# EAGLE design esc (EAGLE 7.6.0)
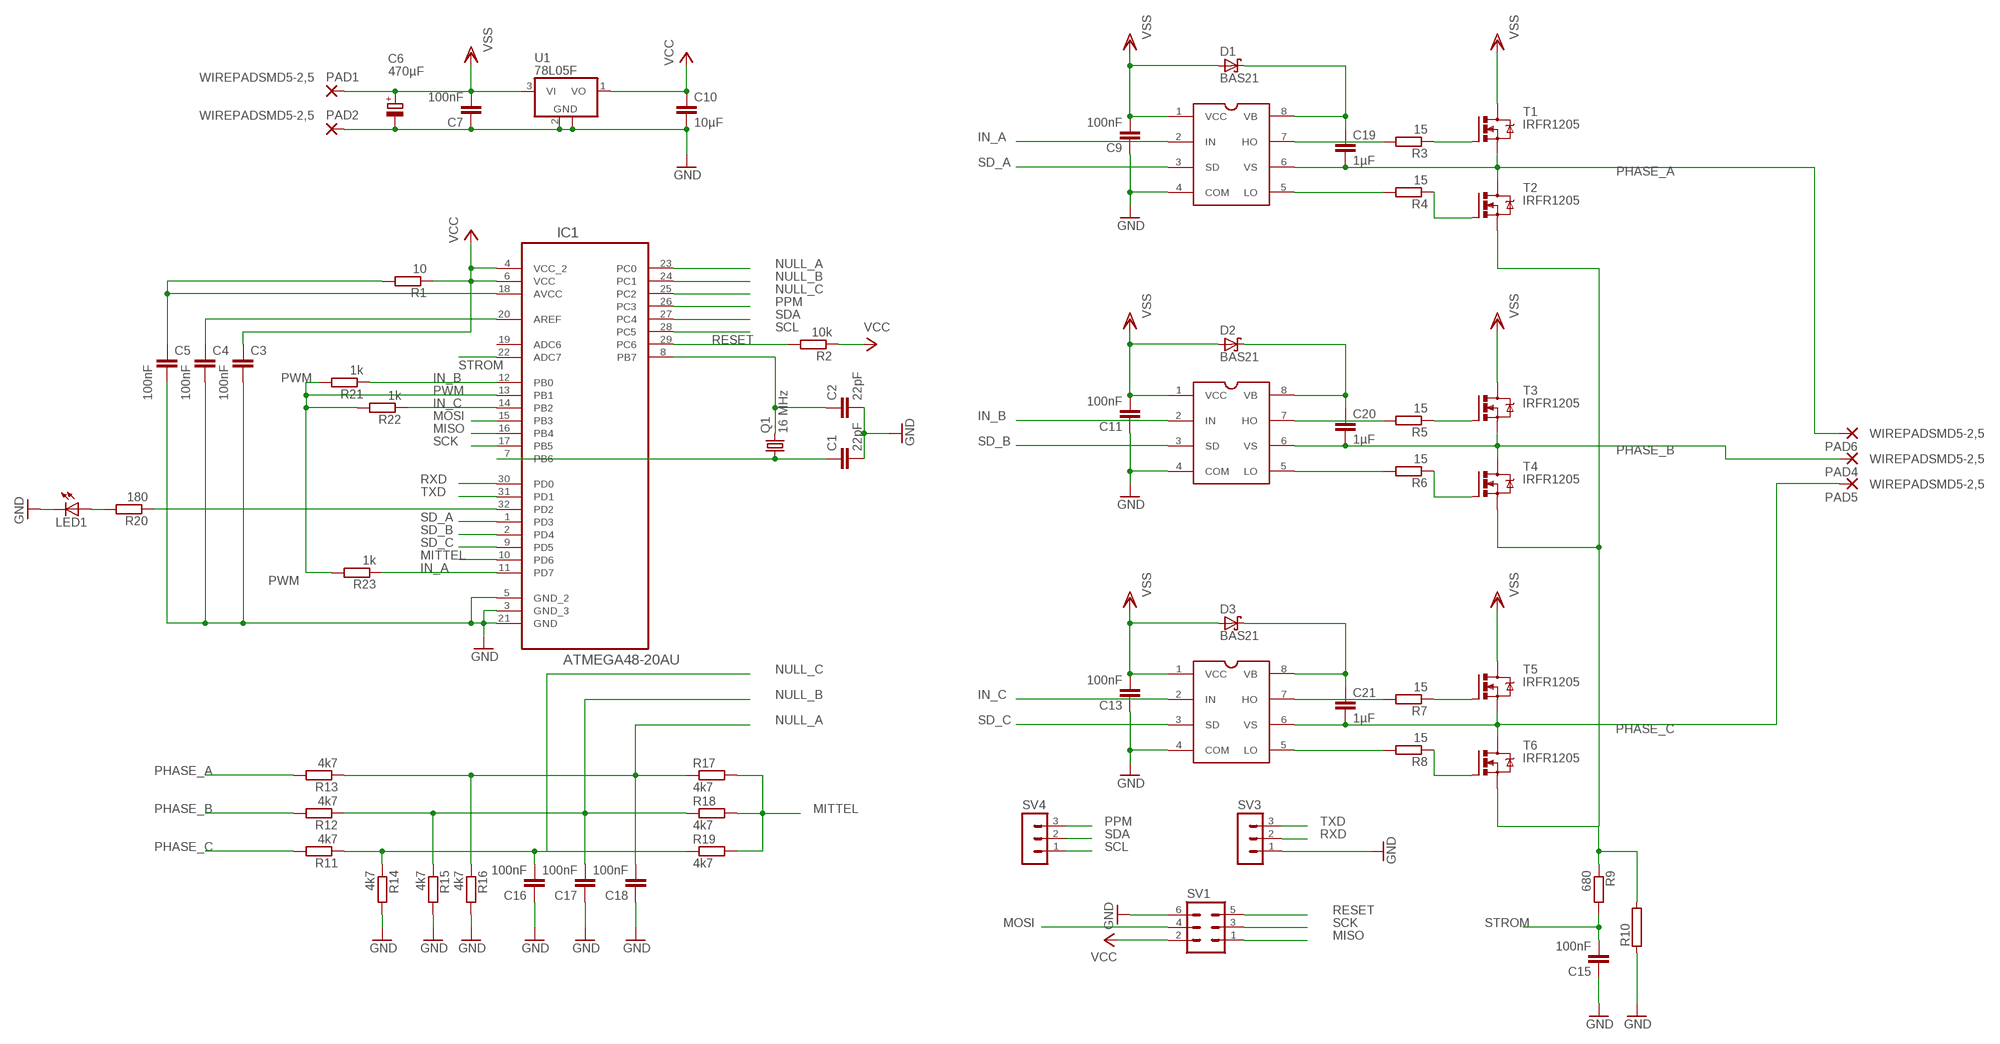
[diagram p0: schematic, sheet 1]

## Parts
C1  22pF  C-EUC1206  [C1206]
C2  22pF  C-EUC1206  [C1206]
C3  100nF  C-EUC1206  [C1206]
C4  100nF  C-EUC1206  [C1206]
C5  100nF  C-EUC1206  [C1206]
C6  470µF  CPOL-EUE5-10.5  [E5-10,5]
C7  100nF  C-EUC1206  [C1206]
C9  100nF  C-EUC1206  [C1206]
C10  10µF  C-EUC1206  [C1206]
C11  100nF  C-EUC1206  [C1206]
C13  100nF  C-EUC1206  [C1206]
C15  100nF  C-EUC1206  [C1206]
C16  100nF  C-EUC1206  [C1206]
C17  100nF  C-EUC1206  [C1206]
C18  100nF  C-EUC1206  [C1206]
C19  1µF  C-EUC1206  [C1206]
C20  1µF  C-EUC1206  [C1206]
C21  1µF  C-EUC1206  [C1206]
D1  BAS21  BAS40  [SOT23]
D2  BAS21  BAS40  [SOT23]
D3  BAS21  BAS40  [SOT23]
IC1  ATMEGA48-20AU  [QFP80P900X900X120-32N]
LED1  LEDCHIPLED_1206  [CHIPLED_1206]
PAD1  WIREPADSMD5-2,5  [5-2,5]
PAD2  WIREPADSMD5-2,5  [5-2,5]
PAD4  WIREPADSMD5-2,5  [5-2,5]
PAD5  WIREPADSMD5-2,5  [5-2,5]
PAD6  WIREPADSMD5-2,5  [5-2,5]
Q1  16 MHz  CRYSTALHC49UP  [HC49UP]
R1  10  R-EU_R1206  [R1206]
R2  10k  R-EU_R1206  [R1206]
R3  15  R-EU_R1206  [R1206]
R4  15  R-EU_R1206  [R1206]
R5  15  R-EU_R1206  [R1206]
R6  15  R-EU_R1206  [R1206]
R7  15  R-EU_R1206  [R1206]
R8  15  R-EU_R1206  [R1206]
R9  680  R-EU_R1206  [R1206]
R10  RCA5150  [CA5150]
R11  4k7  R-EU_R1206  [R1206]
R12  4k7  R-EU_R1206  [R1206]
R13  4k7  R-EU_R1206  [R1206]
R14  4k7  R-EU_R1206  [R1206]
R15  4k7  R-EU_R1206  [R1206]
R16  4k7  R-EU_R1206  [R1206]
R17  4k7  R-EU_R1206  [R1206]
R18  4k7  R-EU_R1206  [R1206]
R19  4k7  R-EU_R1206  [R1206]
R20  180  R-EU_R1206  [R1206]
R21  1k  R-EU_R1206  [R1206]
R22  1k  R-EU_R1206  [R1206]
R23  1k  R-EU_R1206  [R1206]
SV1  ML6  [ML6]
SV3  MA03-1  [MA03-1]
SV4  MA03-1  [MA03-1]
T1  IRFR1205  [DPACK]
T2  IRFR1205  [DPACK]
T3  IRFR1205  [DPACK]
T4  IRFR1205  [DPACK]
T5  IRFR1205  [DPACK]
T6  IRFR1205  [DPACK]
U1  78L05F  [SOT89]
U$1  IR2104S  [IR2104S]
U$2  IR2104S  [IR2104S]
U$3  IR2104S  [IR2104S]

## Nets
GND: C1.2 C2.2 C3.2 C4.2 C5.2 C6.- C7.1 C9.1 C10.2 C11.1 C13.1 C15.1 C16.1 C17.1 C18.1 IC1.3(GND_3) IC1.5(GND_2) IC1.21(GND) LED1.C PAD2.1(P) R10.1 R14.2 R15.2 R16.2 SV1.6 SV3.1 U1.2(GND) U1.2@1(GND) U$1.4(COM) U$2.4(COM) U$3.4(COM)
IN_A: IC1.11(PD7) R23.1 U$1.2(IN)
IN_B: IC1.12(PB0) R21.1 U$2.2(IN)
IN_C: IC1.14(PB2) R22.1 U$3.2(IN)
MISO: IC1.16(PB4) SV1.1
MITTEL: IC1.10(PD6) R17.2 R18.2 R19.2
MOSI: IC1.15(PB3) SV1.4
N$1: C1.1 IC1.7(PB6) Q1.1
N$2: C5.1 IC1.18(AVCC) R1.2
N$3: C2.1 IC1.8(PB7) Q1.2
N$4: C4.1 IC1.20(AREF)
N$5: R3.1 T1.1(G)
N$6: R4.1 T2.1(G)
N$8: R9.1 R10.2 T2.3(S) T4.3(S) T6.3(S)
N$9: C20.1 D2.3(C) U$2.8(VB)
N$10: C19.1 D1.3(C) U$1.8(VB)
N$11: R5.2 U$2.7(HO)
N$12: R3.2 U$1.7(HO)
N$13: R4.2 U$1.5(LO)
N$14: R6.2 U$2.5(LO)
N$15: R5.1 T3.1(G)
N$16: R6.1 T4.1(G)
N$17: LED1.A R20.2
N$18: C21.1 D3.3(C) U$3.8(VB)
N$19: R7.2 U$3.7(HO)
N$20: R8.2 U$3.5(LO)
N$21: R7.1 T5.1(G)
N$22: R8.1 T6.1(G)
N$24: IC1.32(PD2) R20.1
NULL_A: C18.2 IC1.23(PC0) R13.1 R16.1 R17.1
NULL_B: C17.2 IC1.24(PC1) R12.1 R15.1 R18.1
NULL_C: C16.2 IC1.25(PC2) R11.1 R14.1 R19.1
PHASE_A: C19.2 PAD6.1(P) R13.2 T1.3(S) T2.2(D) U$1.6(VS)
PHASE_B: C20.2 PAD4.1(P) R12.2 T3.3(S) T4.2(D) U$2.6(VS)
PHASE_C: C21.2 PAD5.1(P) R11.2 T5.3(S) T6.2(D) U$3.6(VS)
PPM: IC1.26(PC3) SV4.3
PWM: IC1.13(PB1) R21.2 R22.2 R23.2
RESET: IC1.29(PC6) R2.2 SV1.5
RXD: IC1.30(PD0) SV3.2
SCK: IC1.17(PB5) SV1.3
SCL: IC1.28(PC5) SV4.1
SD_A: IC1.1(PD3) U$1.3(SD)
SD_B: IC1.2(PD4) U$2.3(SD)
SD_C: IC1.9(PD5) U$3.3(SD)
SDA: IC1.27(PC4) SV4.2
STROM: C15.2 IC1.22(ADC7) R9.2
TXD: IC1.31(PD1) SV3.3
VCC: C3.1 C10.1 IC1.4(VCC_2) IC1.6(VCC) R1.1 R2.1 SV1.2 U1.1(VO)
VSS: C6.+ C7.2 C9.2 C11.2 C13.2 D1.1(A) D2.1(A) D3.1(A) PAD1.1(P) T1.2(D) T3.2(D) T5.2(D) U1.3(VI) U$1.1(VCC) U$2.1(VCC) U$3.1(VCC)
Unconnected: IC1.19(ADC6)

## Library data of the parts
C1-C5 C7 C9-C11 C13 C15-C21 = rcl:C-EU: CAPACITOR, European symbol
C6 = rcl:CPOL-EU: POLARIZED CAPACITOR, European symbol
D1-D3 = diode:BAS40: Silicon Schottky Diodes General-purpose diode for high-speed switching
IC1 = Atmel_By_element14_Batch_1-00:ATMEGA48-20AU: 8-bit Microcontroller with 8K Bytes In-System Programmable Flash; MPN: ATMEGA48-20AU; OC_FARNELL: 9171312; OC_NEWARK: 68T2999; PACKAGE: TQFP-32; SUPPLIER: Atmel
LED1 = led:LED: LED OSRAM: - CHIPLED LG R971, LG N971, LY N971, LG Q971, LY Q971, LO R971, LY R971 LH N974, LH R974 LS Q976, LO Q976, LY Q976 LO Q996 - Hyper CHIPLED LW Q18S LB Q993, LB Q99A, LB R99A - SideLED LS A670, LO A670, LY A670, LG A670, LP A670 LB A673, LV A673, LT A673, LW A673 LH A674 LY A675 LS A676, LA A676, LO A676, LY A676, LW A676 LS A679, LY A679, LG A679 - Hyper Micro SIDELED® LS Y876, LA Y876, LO Y876, LY Y876 LT Y87S - SmartLED LW L88C, LW L88S LB L89C, LB L89S, LG L890 LS L89K, LO L89K, LY L89K LS L896, LA L896, LO L896, LY L896 - TOPLED LS T670, LO T670, LY T670, LG T670, LP T670 LSG T670, LSP T670, LSY T670, LOP T670, LYG T670 LG T671, LOG T671, LSG T671 LB T673, LV T673, LT T673, LW T673 LH T674 LS T676, LA T676, LO T676, LY T676, LB T676, LH T676, LSB T676, LW T676 LB T67C, LV T67C, LT T67C, LS T67K, LO T67K, LY T67K, LW E67C LS E67B, LA E67B, LO E67B, LY E67B, LB E67C, LV E67C, LT E67C LW T67C LS T679, LY T679, LG T679 LS T770, LO T770, LY T770, LG T770, LP T770 LB T773, LV T773, LT T773, LW T773 LH T774 LS E675, LA E675, LY E675, LS T675 LS T776, LA T776, LO T776, LY T776, LB T776 LHGB T686 LT T68C, LB T68C - Hyper Mini TOPLED® LB M676 - Mini TOPLED Santana® LG M470 LS M47K, LO M47K, LY M47K Source: http://www.osram.convergy.de LUXEON: - LUMILED® LXK2-PW12-R00, LXK2-PW12-S00, LXK2-PW14-U00, LXK2-PW14-V00 LXK2-PM12-R00, LXK2-PM12-S00, LXK2-PM14-U00 LXK2-PE12-Q00, LXK2-PE12-R00, LXK2-PE12-S00, LXK2-PE14-T00, LXK2-PE14-U00 LXK2-PB12-K00, LXK2-PB12-L00, LXK2-PB12-M00, LXK2-PB14-N00, LXK2-PB14-P00, LXK2-PB14-Q00 LXK2-PR12-L00, LXK2-PR12-M00, LXK2-PR14-Q00, LXK2-PR14-R00 LXK2-PD12-Q00, LXK2-PD12-R00, LXK2-PD12-S00 LXK2-PH12-R00, LXK2-PH12-S00 LXK2-PL12-P00, LXK2-PL12-Q00, LXK2-PL12-R00 Source: www.luxeon.com KINGBRIGHT: KA-3528ASYC Source: www.kingbright.com
PAD1 PAD2 PAD4-PAD6 = wirepad:WIREPAD: Wire PAD connect wire on PCB
Q1 = crystal:CRYSTAL: CRYSTAL; OC_FARNELL: unknown; OC_NEWARK: unknown
R1-R9 R11-R23 = rcl:R-EU_: RESISTOR, European symbol
R10 = resistor-power:R: Power Resitor; OC_FARNELL: unknown; OC_NEWARK: unknown
SV1 = con-ml:ML6: HARTING; OC_FARNELL: unknown; OC_NEWARK: unknown
SV3 SV4 = con-lstb:MA03-1: PIN HEADER; OC_FARNELL: unknown; OC_NEWARK: unknown
T1-T6 = IRF:IRFR1205
U1 = linear:78L*: POSITOIV-VOLTAGE REGULATORS Output up to 100 mA Source: http://focus.ti.com/lit/ds/symlink/ua78l05.pdf
U$1-U$3 = ir-2104:IR2104S: Half Bridge Mosfet - IGBT driver SOIC

## Board
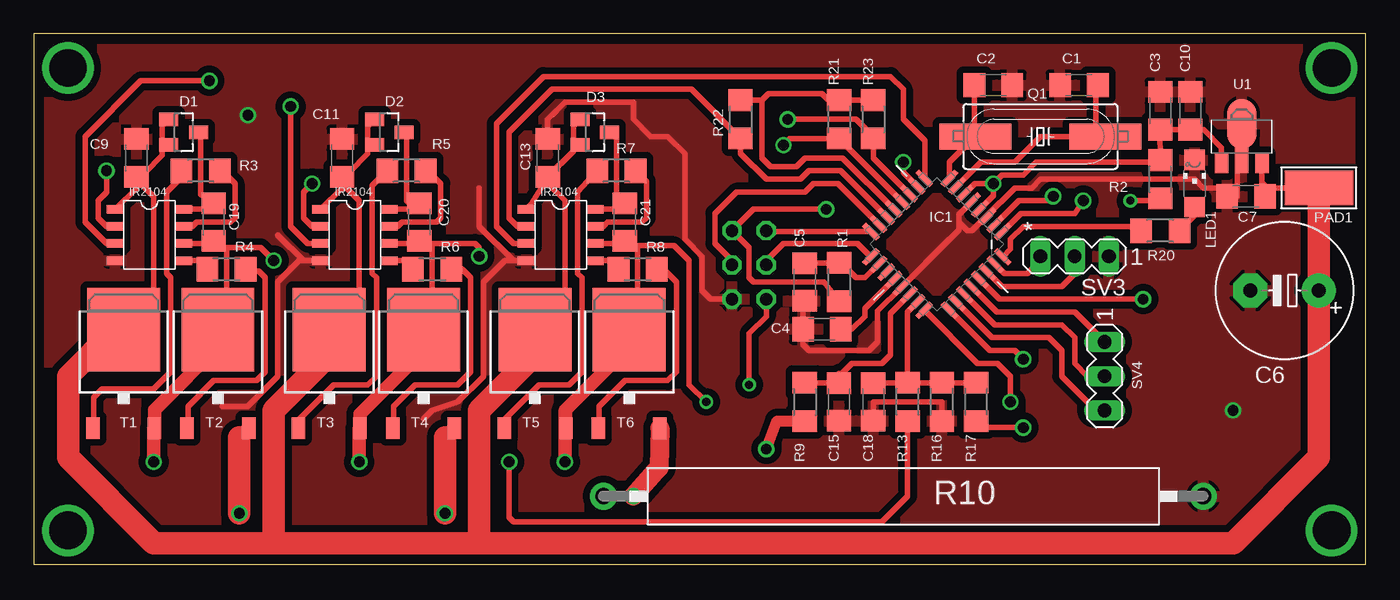
[diagram p1: board, top side]
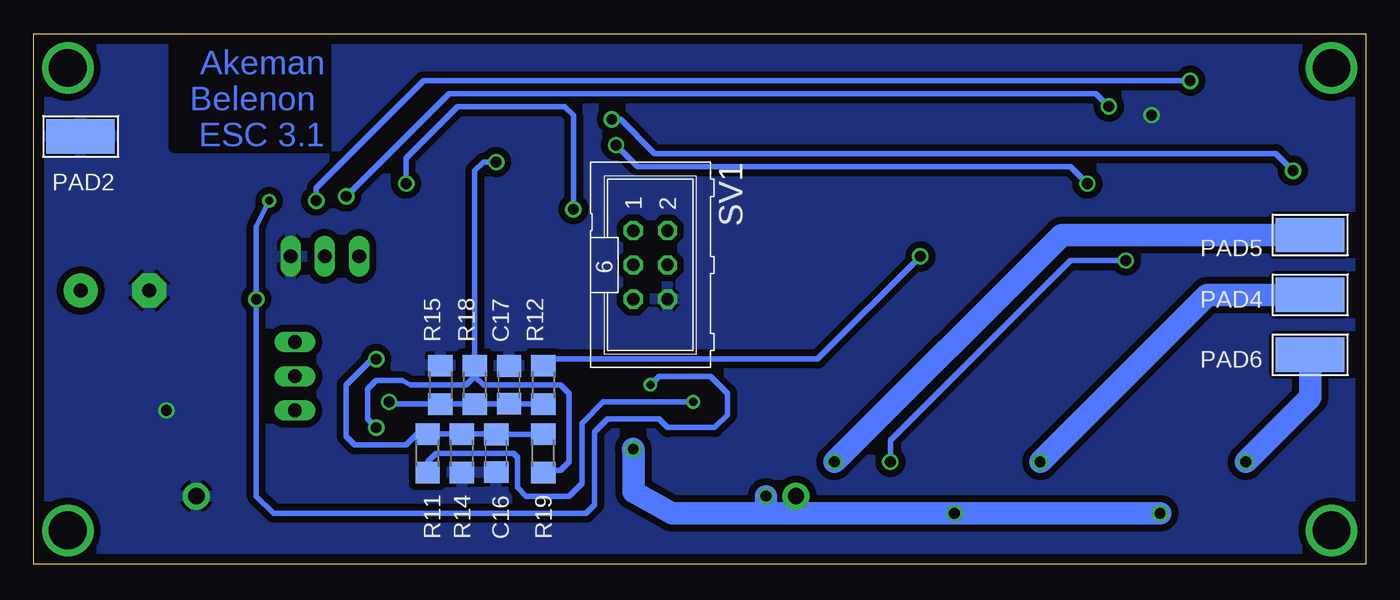
[diagram p2: board, bottom side, seen from below]

Size 98.73 x 39.35 mm. Coordinates in mm from the lower left corner, seen from the top.
Outline: 0,39.35 0,0 98.73,0 98.73,39.35 0,39.35
Copper layers (1*16): Top 0.035mm / dielectric 1.5mm / Bottom 0.035mm
Design rules "akeman *": minimum track width 16mil, minimum drill 32mil, track to track 20mil, track to pad 20mil, pad to pad 5mil, via to via 40mil, smd to smd 5mil, copper to edge 30mil, drill to drill 30mil, minimum pad ring 10mil, minimum via ring 8mil, stop-mask expansion 4mil, vias tented up to drill 0mil, thermal gap 10mil

### Footprints (pad centres in the part's own frame; a part is rotated, then mirrored left to right if it is on the bottom)
C1206 = smd 1.6 x 1.8: 1 -1.4,0; 2 1.4,0
E5-10,5 = drill 1.016 pad 2.54: + -2.54,0 | drill 1.016 pad 2.54 octagon: - 2.54,0
SOT23 = smd 1 x 1.4: 1 -0.95,-1.1; 2 0.95,-1.1; 3 0,1.1
QFP80P900X900X120-32N = smd 1.473 x 0.381: 1 -4.115,2.794; 2 -4.115,2.007; 3 -4.115,1.194; 4 -4.115,0.406; 5 -4.115,-0.406; 6 -4.115,-1.194; 7 -4.115,-2.007; 8 -4.115,-2.794; 17 4.115,-2.794; 18 4.115,-2.007; 19 4.115,-1.194; 20 4.115,-0.406; 21 4.115,0.406; 22 4.115,1.194; 23 4.115,2.007; 24 4.115,2.794 | smd 0.381 x 1.473: 9 -2.794,-4.115; 10 -2.007,-4.115; 11 -1.194,-4.115; 12 -0.406,-4.115; 13 0.406,-4.115; 14 1.194,-4.115; 15 2.007,-4.115; 16 2.794,-4.115; 25 2.794,4.115; 26 2.007,4.115; 27 1.194,4.115; 28 0.406,4.115; 29 -0.406,4.115; 30 -1.194,4.115; 31 -2.007,4.115; 32 -2.794,4.115
CHIPLED_1206 = smd 1.5 x 1.5: A 0,-1.75; C 0,1.75
5-2,5 = smd 2.54 x 5.08: 1 0,0
HC49UP = smd 5.334 x 1.93: 1 -4.826,0; 2 4.826,0
R1206 = smd 1.6 x 1.803: 1 -1.422,0; 2 1.422,0
CA5150 = drill 1.2 pad 2: 1 -22.225,0; 2 22.225,0
ML6 = drill 0.914 octagon: 1 -2.54,-1.27; 2 -2.54,1.27; 3 0,-1.27; 4 0,1.27; 5 2.54,-1.27; 6 2.54,1.27
MA03-1 = drill 1.016 long: 1 -2.54,0; 2 0,0; 3 2.54,0
DPACK = smd 1 x 1.6: 1 -2.28,-4.8; 3 2.28,-4.8 | smd 5.4 x 6.2: 2 0,2.5
SOT89 = smd 1 x 1.5: 1 -1.499,-1.981; 3 1.499,-1.981 | smd 1 x 2: 2 0,-1.727 | smd 2.2 x 3.7: 2@1 0,0.94
IR2104S = smd 1.27 x 0.635: 1 0,3.81; 2 0,2.54; 3 0,1.27; 4 0,0; 5 5.08,0; 6 5.08,1.27; 7 5.08,2.54; 8 5.08,3.81

### Placement (x,y rotation side)
C1  77.47,35.54 180 top
C2  71.12,35.54 0 top
C3  83.5,33.63 90 top
C4  58.42,17.44 180 top
C5  57.15,20.93 270 top
C6  92.71,20.3 180 top
C7  89.85,27.29 0 top
C9  7.62,30.14 270 top
C10  85.72,33.63 90 top
C11  22.86,30.14 270 top
C13  38.1,30.14 270 top
C15  59.69,12.04 90 top
C16  64.45,8.24 90 bottom
C17  63.5,13.32 270 bottom
C18  62.23,12.04 90 top
C19  13.34,25.38 270 top
C20  28.57,25.38 270 top
C21  43.81,25.38 270 top
D1  11.11,32.05 270 top
D2  26.35,32.05 270 top
D3  41.59,32.05 270 top
IC1  66.94,23.74 225 top
LED1  86.04,28.24 0 top
PAD1  95.25,27.92 90 top
PAD2  95.25,31.73 90 bottom
PAD4  4.13,19.98 270 bottom
PAD5  4.13,24.43 90 bottom
PAD6  4.13,15.54 270 bottom
Q1  74.61,31.73 180 top
R1  59.69,20.93 90 top
R2  83.5,28.55 270 top
R3  12.38,29.19 0 top
R4  14.29,21.89 180 top
R5  27.62,29.19 0 top
R6  29.53,21.89 180 top
R7  43.18,29.19 0 top
R8  44.77,21.89 180 top
R9  57.15,12.04 90 top
R10  64.45,5.06 180 top
R11  69.53,8.24 270 bottom
R12  60.96,13.32 90 bottom
R13  64.77,12.04 270 top
R14  66.99,8.24 270 bottom
R15  68.58,13.32 90 bottom
R16  67.31,12.04 270 top
R17  69.85,12.04 270 top
R18  66.04,13.32 90 bottom
R19  60.96,8.24 270 bottom
R20  83.5,24.75 0 top
R21  59.69,33 90 top
R22  52.39,33 90 top
R23  62.23,33 90 top
SV1  53.02,22.21 270 bottom
SV3  77.15,22.84 180 top
SV4  79.38,13.95 270 top
T1  6.67,14.9 0 top
T2  13.65,14.9 0 top
T3  21.91,14.9 0 top
T4  28.89,14.9 0 top
T5  37.15,14.9 0 top
T6  44.13,14.9 0 top
U1  89.53,31.73 0 top
U$1  6.03,22.52 0 top
U$2  21.27,22.52 0 top
U$3  36.51,22.52 0 top

### Tracks (layer width: path | path; a pad name or v marks a point on that pad's centre or on a via)
GND  (via drill 0.8)
  Top 0.406: IC1.5 68.58,25.96 68.58,25.38 | 68.58,25.38 69.22,24.75 69.53,24.75 70.59,25.8 | 70.59,25.8 IC1.3 | 68.58,25.38 68.58,24.8 IC1.21 | IC1.21 67.89,24.11 | IC1.21 62.55,18.77 62.55,16.49 61.91,15.86 57.47,15.86 57.02,16.3 C4.2 57.02,19.35 C5.2 | 18.1,24.43 20,22.52 U$2.4 19.68,22.52 18.1,20.93 18.1,13.95 15.88,11.73 13.97,11.73 | 28.89,10.78 29.53,11.41 31.43,12.04 33.34,13.95 33.34,20.93 34.92,22.52 U$3.4 35.56,22.52 33.02,25.06 33.02,27.92 | 62.23,10.78 62.23,12.04 67.31,12.04 67.31,10.78 | 38.73,33.63 38.42,33.32 | 70.59,25.8 72.71,27.92 73.98,27.92 74.61,28.55 86.04,28.55 86.68,27.92 87.63,27.92 | C13.1 38.1,33 39.37,34.27 44.45,34.27 44.45,33 45.72,31.73 46.99,31.73 48.26,30.46 48.26,24.11 49.53,22.84 49.53,20.3 50.16,19.66 SV1.6 | U1.2 89.22,29.69 89.22,27.29 C7.1
  other vias: 88.9,11.41 15.88,33.32
  pour Top: 0,-0.02 99.06,-0.02 99.06,39.35 0,39.35
  pour Bottom: 0,-0.02 99.06,-0.02 99.06,39.35 0,39.35
IN_A  (via drill 0.8)
  Top 0.406: IC1.11 62.23,30.13 R23.1 62.23,31.73 60.96,33 v55.88,33 | U$1.2 5.4,25.06 4.76,25.7 4.76,26.97 5.4,27.6 v5.4,29.19
  Bottom 0.406: v55.88,33 55.24,33 52.7,30.46 6.67,30.46 v5.4,29.19
IN_B  (via drill 0.8)
  Top 0.406: IC1.12 59.69,31.56 | 59.69,31.56 R21.1 59.69,31.73 | U$2.2 20.64,25.06 20,25.7 20,27.6 v20.64,28.24 | 59.69,31.56 56.03,31.56 v55.56,31.09
  Bottom 0.406: v55.56,31.09 53.98,29.51 21.91,29.51 v20.64,28.24
IN_C
  Top 0.406: IC1.14 59.8,29.19 57.47,29.19 56.83,28.55 54.29,28.55 52.39,30.46 R22.1 48.74,35.22 38.42,35.22 35.24,32.05 35.24,25.7 35.88,25.06 U$3.2
MISO
  Top 0.406: SV1.1 54.37,24.67 IC1.16
MITTEL  (via drill 0.8)
  Top 0.406: IC1.10 64.45,29.06 v64.45,29.82 | R17.2 70,10.78 69.85,10.14 v73.34,10.14
  Bottom 0.406: v73.34,10.14 73.98,10.78 73.98,13 73.34,13.63 71.44,13.63 70.8,13.32 66.67,13.32 66.04,13.95 | R19.2 60.81,6.97 59.69,6.97 59.05,7.6 59.05,12.68 59.69,13.32 65.41,13.32 66.04,13.95 | 66.04,13.95 R18.2 66.04,29.19 65.41,29.82 v64.45,29.82
MOSI
  Top 0.406: IC1.15 59.6,28.24 57.78,28.24 57.15,27.6 52.07,27.6 50.48,26.02 50.48,23.79 51.75,22.52 SV1.4
N$1
  Top 0.406: IC1.7 70.19,29.82 72.71,29.82 74.61,31.73 Q1.1 78.74,31.73 78.74,35.41 C1.1
N$2
  Top 0.406: IC1.18 61.62,21.25 60.96,21.25 60.01,22.21 R1.2 59.35,22.34 C5.1
N$3
  Top 0.406: C2.1 69.72,32.11 Q1.2 67.87,29.82 IC1.8
N$4
  Top 0.406: IC1.20 61.59,18.97 61.59,18.39 60.64,17.44 C4.1
N$5
  Top 0.406: R3.1 10.96,28.72 9.84,27.6 9.84,21.57 10.16,21.25 10.16,14.27 8.89,13 5.08,13 4.45,12.36 4.45,10.16 T1.1
N$6
  Top 0.406: R4.1 16.66,21.74 17.14,21.25 17.14,14.27 16.51,13.63 13.34,13.63 11.43,11.73 11.43,10.16 T2.1
N$8  (via drill 0.8)
  Top 0.813: v54.29,8.55 55.09,10.62 R9.1
  Top 1.016: 15.24,9.41 T2.3 | T4.3 30.48,9.41
  Top 1.422: T6.3 46.35,7.19 v44.45,5.06
  Top 1.676: v15.24,3.79 15.24,9.41 | 30.48,9.41 v30.48,3.79
  Bottom 1.27: v54.29,8.55 v54.28,8.55 | R10.2 41.91,3.79
  Bottom 1.676: 44.45,3.79 51.44,3.79 54.28,5.37 v54.28,8.54 v54.29,8.55 | 44.45,3.79 41.91,3.79 v30.48,3.79 v15.24,3.79 | v44.45,5.06 44.45,3.79
N$9
  Top 0.406: U$2.8 27.81,26.33 C20.1 27.81,26.78 27.62,26.97 27.62,31.88 D2.3
N$10
  Top 0.406: U$1.8 12.57,26.33 C19.1 12.38,27.41 12.38,31.88 D1.3
N$11
  Top 0.406: R5.2 29.21,29.19 30.16,28.24 30.16,25.7 29.84,25.38 27.3,25.38 26.99,25.06 U$2.7
N$12
  Top 0.406: U$1.7 11.75,25.06 12.06,25.38 14.61,25.38 14.92,25.7 14.92,28.24 13.8,29.36 R3.2
N$13
  Top 0.406: U$1.5 12.23,22.52 R4.2
N$14
  Top 0.406: U$2.5 27.47,22.52 R6.2
N$15
  Top 0.406: R5.1 25.08,28.07 25.08,21.57 25.4,21.25 25.4,13.95 24.77,13.32 22.23,13.32 19.63,10.72 T3.1
N$16
  Top 0.406: R6.1 31.75,21.89 32.38,21.25 32.38,14.27 31.43,13.32 28.26,13.32 26.67,11.73 26.67,10.16 T4.1
N$17
  Top 0.406: R20.2 86.04,25.86 LED1.A
N$18
  Top 0.406: U$3.8 43.05,26.33 C21.1 43.18,27.1 43.18,31.56 D3.3
N$19
  Top 0.406: 41.91,25.06 U$3.7 42.23,25.06 42.55,25.38 45.09,25.38 45.4,25.7 45.4,28.39 R7.2
N$20
  Top 0.406: U$3.5 42.71,22.52 R8.2
N$21
  Top 0.406: T5.1 34.87,10.72 37.47,13.32 39.69,13.32 40.64,14.27 40.64,21.25 40.32,21.57 40.32,27.6 R7.1
N$22
  Top 0.406: R8.1 46.67,21.89 47.62,20.93 47.62,14.27 46.99,13.63 43.81,13.63 41.91,11.73 41.91,10.16 T6.1
N$23  (via drill 2.8)
  other vias: 2.54,36.81
N$24
  Top 0.406: IC1.32 72.39,23.37 72.39,24.11 73.34,25.06 81.28,25.06 81.6,24.75 R20.1
N$25  (via drill 2.8)
  other vias: 2.54,2.52
N$26  (via drill 2.8)
  other vias: 96.2,2.52
N$27  (via drill 2.8)
  other vias: 96.2,36.81
NULL_A
  Top 0.406: C18.2 62.25,13.47 R13.1 | R13.1 R16.1 R17.1 | IC1.23 64.77,18.73 R13.1
NULL_B  (via drill 0.8)
  Top 0.406: IC1.24 69.95,14.9 71.44,14.9 72.39,13.95 v72.39,12.04
  Bottom 0.406: R12.1 60.98,11.92 C17.2 63.52,11.89 R18.1 R15.1 72.24,11.89 v72.39,12.04
NULL_C  (via drill 0.8)
  Top 0.406: IC1.25 70.87,15.86 72.71,15.86 v73.34,15.22
  Bottom 0.406: R19.1 60.98,9.63 C16.2 63.52,9.66 R14.1 R11.1 70.33,9.66 71.12,8.87 74.93,8.87 75.56,9.51 75.56,13.32 73.66,15.22 v73.34,15.22
PHASE_A  (via drill 0.8)
  Top 0.406: T2.2 15.24,18.99 15.24,19.03 14.29,19.98 14.29,23.48 | U$1.6 12.83,23.79 C19.2 | C19.2 13.46,23.66 | C19.2 13.46,23.98 13.97,23.48 14.29,23.48 | 14.29,23.48 16.83,23.48 v17.78,22.52 | R13.2 64.77,5.06 62.87,3.15 35.56,3.15 35.24,3.47 v35.24,7.6
  Top 1.016: T2.2 13.97,17.09 13.97,16.49 8.95,11.47 T1.3 8.89,10.04 v8.89,7.6
  Bottom 0.406: v17.78,22.52 21.91,22.52 35.24,9.19 v35.24,7.6
  Bottom 1.676: PAD6.1 4.13,12.36 v8.89,7.6
PHASE_B  (via drill 0.8)
  Top 0.406: 28.07,23.79 U$2.6 29.53,23.79 | 28.07,23.79 C20.2 | 28.07,23.79 28.57,23.79 | 29.53,23.79 29.53,18.71 29.21,18.39 29.21,17.72 T4.2 | 29.53,23.79 32.7,23.79 33.02,23.48 v33.02,22.84
  Top 1.016: T4.2 28.26,16.77 28.26,15.22 24.19,11.15 T3.3 24.13,10.04 v24.13,7.6
  Bottom 0.406: R12.2 60.48,15.22 40.64,15.22 v33.02,22.84
  Bottom 1.676: PAD4.1 11.75,19.98 v24.13,7.6
PHASE_C  (via drill 0.6, 0.8)
  Top 0.406: U$3.6 43.31,23.79 | 43.31,23.79 C21.2 | 43.31,23.79 44.45,23.79 44.61,23.63 | 44.61,23.63 44.77,23.48 44.77,18.04 T6.2 | 44.61,23.63 47.47,23.63 48.58,22.52 48.58,13.32 v49.85,12.04
  Top 1.016: T5.3 39.43,11.41 | 39.43,11.41 39.43,11.47 44.45,16.49 44.45,17.09 T6.2 | v39.37,7.6 39.37,11.35 39.43,11.41
  Bottom 0.406: v49.85,12.04 56.52,12.04 58.1,10.46 58.1,6.01 59.05,5.06 62.23,5.06 62.87,5.7 62.87,7.92 63.18,8.24 68.9,8.24 69.53,7.6 R11.2
  Bottom 1.676: PAD5.1 22.54,24.43 v39.37,7.6
PPM
  Top 0.406: IC1.26 71.03,16.81 75.25,16.81 76.2,15.86 76.2,13.95 78.74,11.41 SV4.3
PWM
  Top 0.406: IC1.13 59.96,30.14 57.15,30.14 56.52,29.51 54.61,29.51 53.98,30.14 53.98,34.42 | 52.7,34.27 R22.2 53.98,34.42 | R23.2 R21.2 58.9,34.42 58.42,34.9 54.46,34.9 53.98,34.42
RESET  (via drill 0.6, 0.8)
  Top 0.406: IC1.29 71.59,19.66 v82.23,19.66 | v81.28,26.97 83.19,26.97 83.5,26.65 R2.2 | SV1.5 54.29,18.39 53.02,17.12 v53.02,13.32
  Bottom 0.406: v81.28,26.97 82.23,25.06 v82.23,19.66 82.23,5.06 80.96,3.79 57.78,3.79 57.15,4.43 57.15,9.82 56.2,10.78 52.39,10.78 51.75,10.14 48.26,10.14 47.31,11.09 47.31,12.68 48.58,13.95 52.39,13.95 v53.02,13.32
RXD
  Top 0.406: SV3.2 77.15,21.57 76.2,20.62 71.75,20.62 IC1.30
SCK
  Top 0.406: IC1.17 61.06,23.79 55.56,23.79 54.29,22.52 SV1.3
SCL
  Top 0.406: IC1.28 71.39,18.71 77.15,18.71 SV4.1
SD_A  (via drill 0.8)
  Top 0.406: U$1.3 5.4,23.79 3.81,25.38 3.81,31.73 7.94,35.86 v13.02,35.86 | IC1.1 73.17,26.02 77.15,26.02 v77.79,26.97
  Bottom 0.406: v13.02,35.86 69.85,35.86 77.79,27.92 v77.79,26.97
SD_B  (via drill 0.8)
  Top 0.406: U$2.3 20.32,23.79 19.05,25.06 v19.05,33.95 | IC1.2 73,26.97 75.25,26.97 arc90 v75.56,27.29
  Bottom 0.406: v75.56,27.29 67.94,34.9 20,34.9 v19.05,33.95
SD_C
  Top 0.406: U$3.3 35.56,23.79 34.29,25.06 34.29,32.68 37.78,36.17 63.5,36.17 64.45,35.22 64.45,33 66.04,31.41 66.04,28.66 IC1.9
SDA
  Top 0.406: IC1.27 71.23,17.76 76.2,17.76 77.15,16.81 77.15,14.9 78.11,13.95 SV4.2
STROM
  Top 0.406: 59.69,14.17 59.69,13.95 | 59.69,13.95 C15.2 59.67,13.47 R9.2 | IC1.22 63.5,18.61 63.5,15.54 62.87,14.9 60.64,14.9 59.69,13.95
TXD
  Top 0.406: IC1.31 71.94,21.57 73.66,21.57 74.61,22.52 SV3.3
VCC  (via drill 0.8)
  Top 0.406: IC1.4 71.12,27.34 v71.12,28.24 | IC1.6 69.75,28.24 v71.12,28.24 | v58.74,26.33 53.34,26.33 SV1.2 53.02,23.48 53.02,21.25 53.34,20.93 58.59,20.93 R1.1 | v71.12,28.24 71.75,28.87 73.34,28.87 74.3,29.82 83.35,29.82 R2.1 83.48,32.21 C3.1 C10.1 86.71,32.23 88.04,30.91 U1.1
  Bottom 0.406: v71.12,28.24 71.12,30.14 67.31,33.95 59.37,33.95 58.74,33.32 v58.74,26.33
VSS
  Top 0.406: T1.2 8.89,19.62 8.89,27.29 8.26,27.92 8.26,29.06 | 8.26,29.06 C9.2 7.62,27.92 U$1.1 | 22.86,27.92 C11.2 23.36,29.06 24.77,30.46 24.77,32.51 D2.1 | U$3.1 36.83,26.65 37.73,28.14 C13.2 | 8.26,29.06 9.53,30.33 9.53,32.51 D1.1 | U$2.1 22.86,27.92 | 22.86,27.92 23.18,27.92 24.13,26.97 24.13,19.66 21.91,17.44 T3.2 | C13.2 40.01,30.65 40.01,32.51 D3.1 | T5.2 37.15,18.08 39.37,20.3 39.37,26.97 38.1,28.24 C13.2 | C7.2 91.44,27.47 91.44,27.92 | 91.44,27.92 91.03,28.33 U1.3 | 91.44,27.92 PAD1.1
  Top 1.016: T1.2 5.99,17.4 | 2.54,13.95 2.54,8.87 | PAD1.1 C6.+
  Top 1.676: PAD1.1 95.25,7.92 88.9,1.57 33.02,1.57 | 33.02,1.57 33.02,11.41 36.83,15.22 36.83,17.09 T5.2 | 33.02,1.57 17.78,1.57 | 17.78,1.57 17.78,11.41 21.59,15.22 21.59,17.09 T3.2 | 5.99,17.4 2.54,13.95 2.54,7.92 8.89,1.57 17.78,1.57

### Text on the board
Bottom: Akeman / Belenon / ESC 3.1